# Altium schematic sheet SCH.schdoc
size 259 x 114 mm
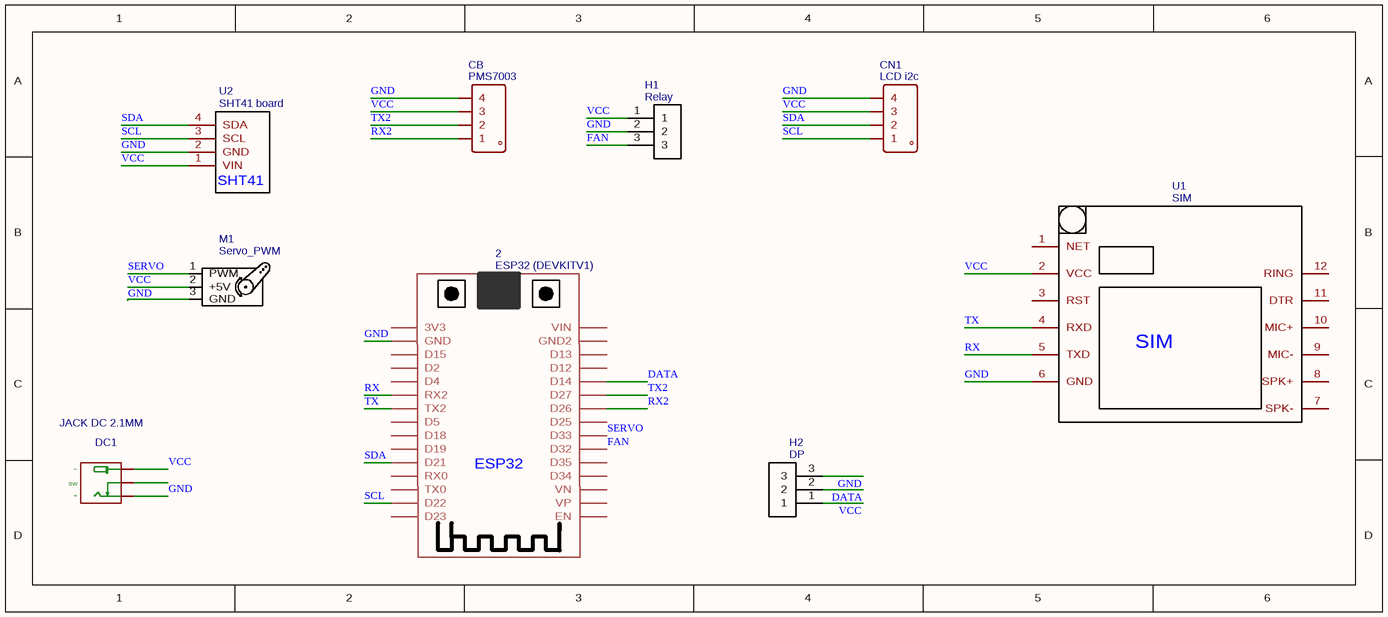
[diagram p0: SCH.schdoc]

## Parts
2  ESP32 (DEVKITV1)  [ESP32-DEVKITV1_ESP32-DEVKITV1]
CB  PMS7003  [PINHEADER-4PIN]
CN1  LCD i2c  [PINHEADER-4PIN]
DC1  JACK DC 2.1MM  [JACKDC2.1MM]
H1  Relay  [HEADER-3PIN]
H2  DP  [HEADER-3PIN]
M1  Servo_PWM  [SERVO]
U1  SIM  [SIM800L]
U2  SHT41 board  [SHT41 BOARD AU]

## Nets
DATA: 2.D14 H2.2
FAN: 2.D32 H1.3
GND: 2.GND CB.4 CN1.4 DC1.+ H1.2 H2.3 M1.3(GND) U1.6(GND) U2.2(GND)
RX: 2.RX2 U1.5(TXD)
RX2: 2.D26 CB.1
SCL: 2.D22 CN1.1 U2.3(SCL)
SDA: 2.D21 CN1.2 U2.4(SDA)
SERVO: 2.D33 M1.1(PWM)
TX: 2.TX2 U1.4(RXD)
TX2: 2.D27 CB.2
VCC: CB.3 CN1.3 DC1.- H1.1 H2.1 M1.2(+5V) U1.2(VCC) U2.1(VIN)

Not connected (* = marked no-connect by the designer): 2 3V3 D2 D4 D5 D12 D13 D15 D18 D19 D23 D25 D34 D35 EN GND2 RX0 TX0 VIN VN VP; DC1 SW; U1 1(NET) 3(RST) 7(SPK-) 8(SPK+) 9(MIC-) 10(MIC+) 11(DTR) 12(RING)

## Notes on the sheet
- (in symbol ESP32 (DEVKITV1)) ESP32
- (in symbol JACK DC 2.1MM) –
- (in symbol LCD i2c) °
- (in symbol PMS7003) °
- (in symbol SHT41 board) SHT41

## Library data of the parts
2 = ESP32 (DEVKITV1): Contributor: savanpandey31; spicePre: ?; spiceSymbolName: ESP32-DEVKIT-V1-30PIN
CB = PMS7003: Contributor: mKenfenheuer; spicePre: C; spiceSymbolName: PINHEADER-4PIN
CN1 = LCD i2c: Contributor: mKenfenheuer; spicePre: C; spiceSymbolName: PINHEADER-4PIN
DC1 = JACK DC 2.1MM: Manufacturer: SHOU HAN; Manufacturer Part: DC022; Contributor: ricarod; Convert to PCB: Yes; Supplier Part: C668598; Supplier: LCSC; Add into BOM: Yes; spicePre: D; spiceSymbolName: JACK DC 2.1MM W/MARKINGS
H1 = Relay: Contributor: patriciamoy857; spicePre: H; spiceSymbolName: HEADER-3PIN
H2 = DP: Contributor: patriciamoy857; spicePre: H; spiceSymbolName: HEADER-3PIN
M1 = Servo_PWM: Contributor: JSiderius; spicePre: M; spiceSymbolName: Servo_PWM
U1 = SIM: Manufacturer: ARCELI; Contributor: ulf.modig; Supplier: Amazon; spicePre: U; spiceSymbolName: SIM800L SMD
U2 = SHT41 board: Contributor: mienkofax; spicePre: U; spiceSymbolName: SHT41 board